# Altium schematic sheet AIRZAI_LED_SENSE_FLEX_REVC.SchDoc
size B
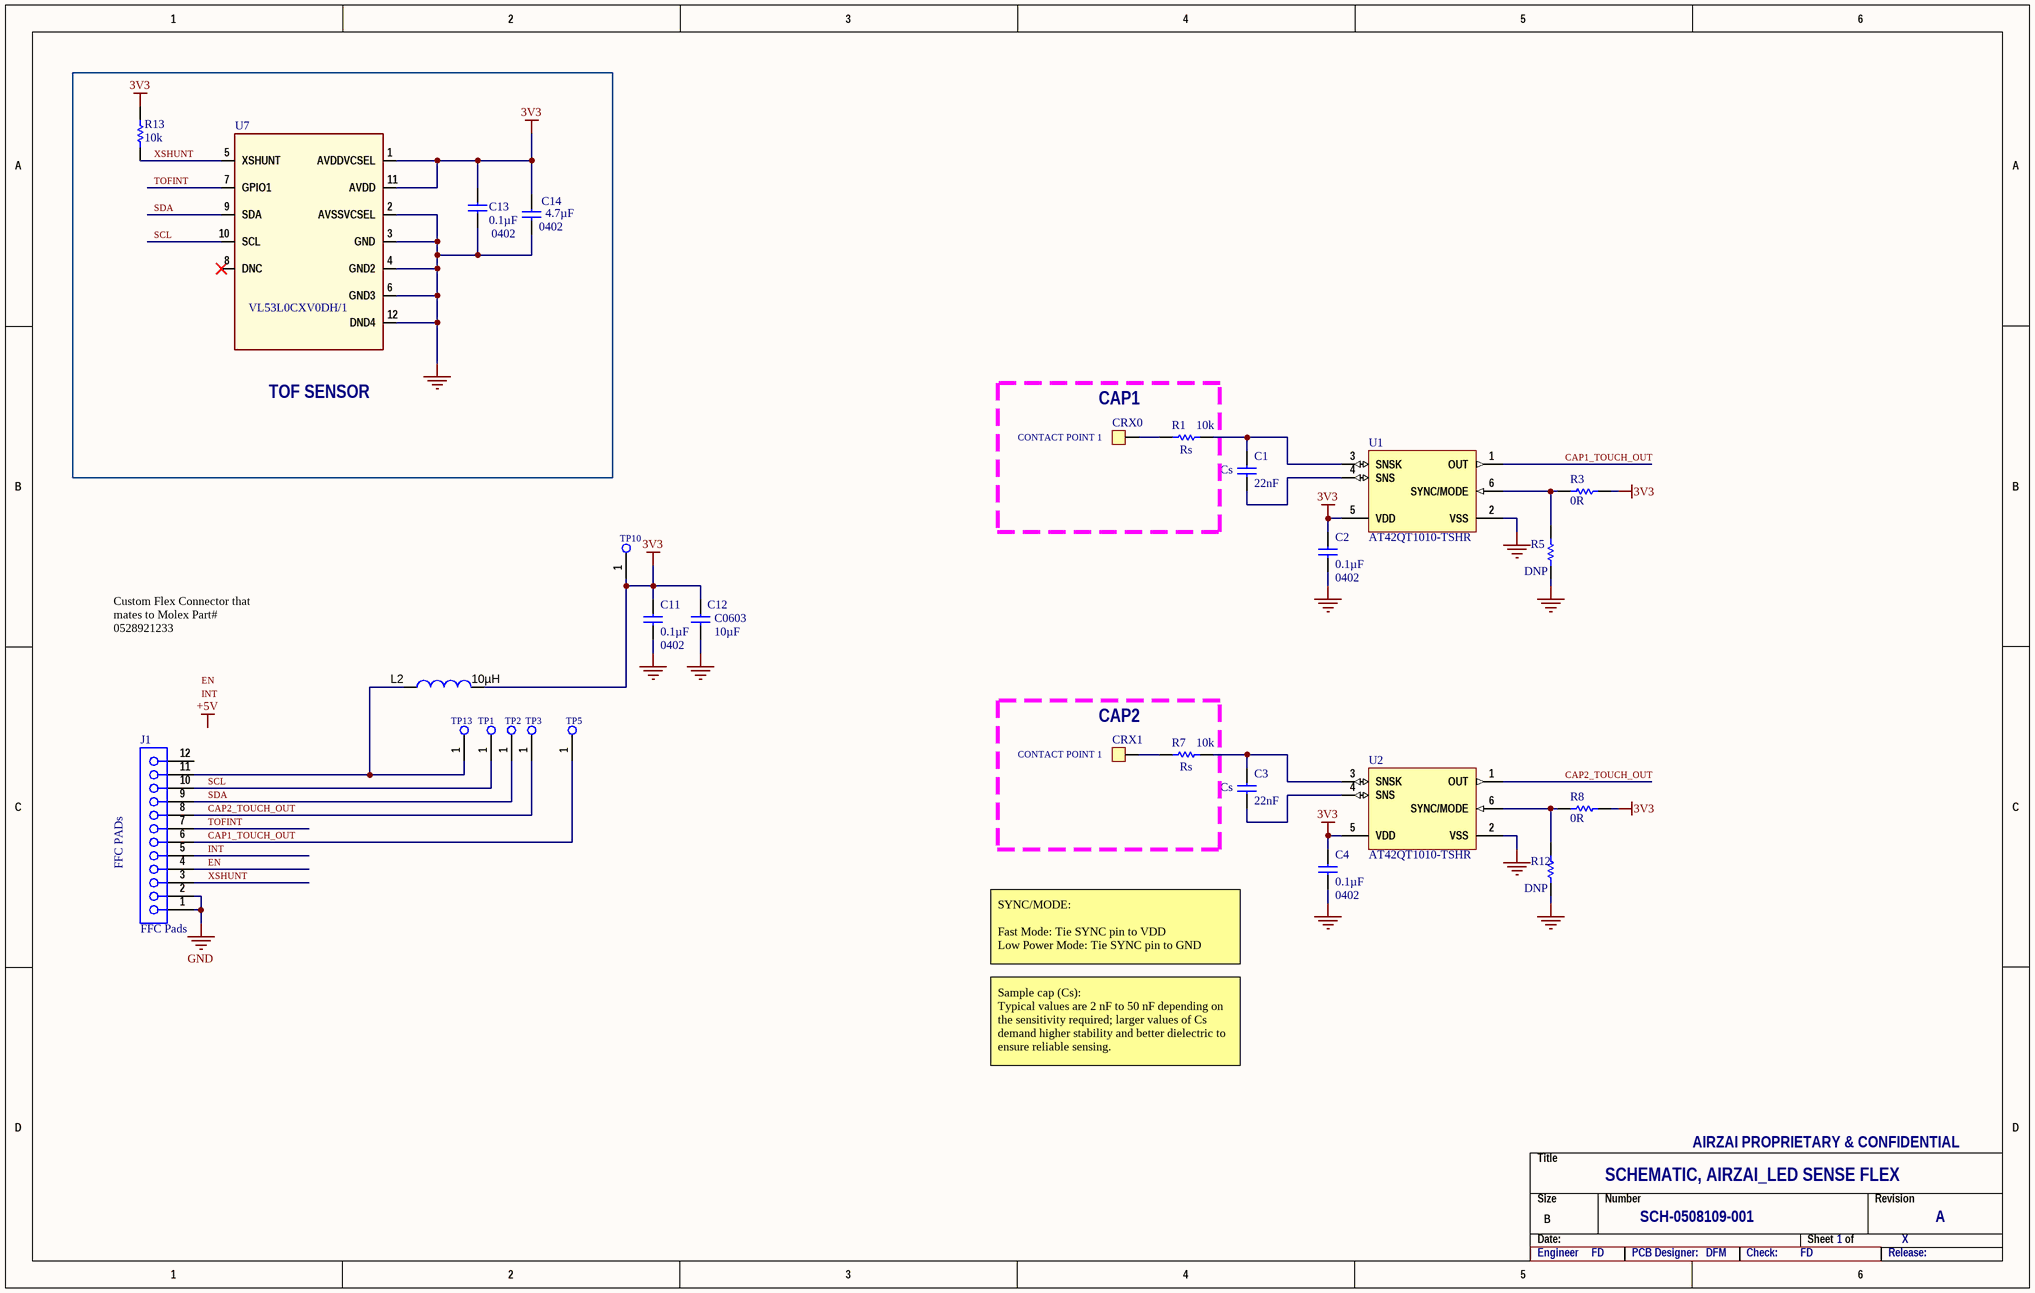
[diagram p0: AIRZAI_LED_SENSE_FLEX_REVC.SchDoc]

## Parts
C1  22nF  [0402CAP]
C2  0.1µF  Footprint: 0402  [0402CAP]
C3  22nF  [0402CAP]
C4  0.1µF  Footprint: 0402  [0402CAP]
C11  0.1µF  Footprint: 0402  [0402CAP]
C12  10µF  Footprint: C0603  [0603]
C13  0.1µF  Footprint: 0402  [0402CAP]
C14  4.7µF  Footprint: 0402  [0603]
CRX0  CONTACT POINT 1  [CONTACT_POINT_1CM _SQ]
CRX1  CONTACT POINT 1  [CONTACT_POINT_1CM _SQ]
J1  FFC Pads  [FFC_Pads]
L2  ValueDisplayed: 10µH  [0805]  (hidden comment: CB2012T100KR)
R1  value 10k  [0402]  (hidden comment: 10k 0402(1005))
R3  value 0R  [0402]  (hidden comment: Jumper 0402(1005))
R5  value DNP  [0402]  (hidden comment: DNP 0402(1005))
R7  value 10k  [0402]  (hidden comment: 10k 0402(1005))
R8  value 0R  [0402]  (hidden comment: Jumper 0402(1005))
R12  value DNP  [0402]  (hidden comment: DNP 0402(1005))
R13  value 10k  [0402]  (hidden comment: 10k 0402(1005))
TP1  Test Point  [TP_0.9MM]  (value not drawn)
TP2  Test Point  [TP_0.9MM]  (value not drawn)
TP3  Test Point  [TP_0.9MM]  (value not drawn)
TP5  Test Point  [TP_0.9MM]  (value not drawn)
TP10  Test Point  [TP_0.9MM]  (value not drawn)
TP13  Test Point  [TP_0.9MM]  (value not drawn)
U1  AT42QT1010-TSHR  [SOT-23-6-AT42QT1010-TSHR]
U2  AT42QT1010-TSHR  [SOT-23-6-AT42QT1010-TSHR]
U7  VL53L0CXV0DH/1  [VL53L0X]

## Blocks framed on the sheet
TOF SENSOR: C13 C14 R13 U7
CAP1: CRX0 R1
CAP2: CRX1 R7

## Nets
3V3: C2.1 C4.1 C11.1 C12.1 C13.1 C14.2 L2.2 R3.2 R8.2 R13.1 TP10.1 U1.5(VDD) U2.5(VDD) U7.1(AVDDVCSEL) U7.11(AVDD)
GND: C2.2 C4.2 C11.2 C12.2 C13.2 C14.1 J1.1 J1.2 R5.2 R12.2 U1.2(VSS) U2.2(VSS) U7.2(AVSSVCSEL) U7.3(GND) U7.4(GND2) U7.6(GND3) U7.12(DND4)
CAP1_TOUCH_OUT: J1.6 TP5.1 U1.1(OUT)
CAP2_TOUCH_OUT: J1.8 TP3.1 U2.1(OUT)
EN: J1.4
INT: J1.5
SCL: J1.10 TP1.1 U7.10(SCL)
SDA: J1.9 TP2.1 U7.9(SDA)
TOFINT: J1.7 U7.7(GPIO1)
XSHUNT: J1.3 R13.2 U7.5(XSHUNT)
NetC1_1: C1.1 R1.1 U1.3(SNSK)
NetC1_2: C1.2 U1.4(SNS)
NetC3_1: C3.1 R7.1 U2.3(SNSK)
NetC3_2: C3.2 U2.4(SNS)
NetCRX0_1: CRX0.1 R1.2
NetCRX1_1: CRX1.1 R7.2
NetJ1_11: J1.11 L2.1 TP13.1
NetR3_1: R3.1 R5.1 U1.6(SYNC/MODE)
NetR8_1: R8.1 R12.1 U2.6(SYNC/MODE)

Not connected (* = marked no-connect by the designer): J1 12; U7 8(DNC)*

## Notes on the sheet
- (near R1) Rs
- (near C1) Cs
- Custom Flex Connector that mates to Molex Part# 0528921233
- (near R7) Rs
- (near C3) Cs
- (near J1) FFC PADs
- SYNC/MODE:
  Fast Mode: Tie SYNC pin to VDD
  Low Power Mode: Tie SYNC pin to GND
- Sample cap (Cs):
  Typical values are 2 nF to 50 nF depending on the sensitivity required; larger values of Cs demand higher stability and better dielectric to ensure reliable sensing.
- SCHEMATIC, AIRZAI_LED SENSE FLEX
- AIRZAI PROPRIETARY & CONFIDENTIAL
- SCH-0508109-001
- 1
- X
- A
- Engineer
- FD
- PCB Designer:
- DFM
- Check:
- Release:
- Labels drawn without touching a wire or pin: +5V, EN, INT

## Library data of the parts
C1 C3 = C0402-100n: Capacitor, X7R, ±10%; Manufacturer: TDK; Manufacturer Part Number: CGA2B2X7R1E223K050BA; Voltage Rating (DC): 25V; Value: 22nF; ComponentLink1URL: http://www.mouser.com/ds/2/281/c02e-2905.pdf?src-supplier=Mouser; ComponentLink1Description: http://www.mouser.com/ds/2/281/c02e-2905.pdf?src-supplier=Mouser; ComponentLink2URL: http://psearch.en.murata.com/capacitor/product/GRM155R71H333KE14%23.pdf?src-supplier=Avnet; ComponentLink2Description: http://psearch.en.murata.com/capacitor/product/GRM155R71H333KE14%23.pdf?src-supplier=Avnet; ComponentLink3URL: http://search.murata.co.jp/Ceramy/image/img/A01X/G101/ENG/GRM155R71H333KE14-01.pdf?src-supplier=Digi-Key; ComponentLink3Description: http://search.murata.co.jp/Ceramy/image/img/A01X/G101/ENG/GRM155R71H333KE14-01.pdf?src-supplier=Digi-Key; Supplier 1: Digi-Key; Supplier Part Number 1: 445-5609-1-ND; Stock 1: 499669; Pricing 1: 1 = 0.10000, 10 = 0.06500, 100 = 0.02910, 500 = 0.02080, 1000 = 0.01635, 2500 = 0.01486, 5000 = 0.01367 (USD); RoHS: Yes; Mount: Surface Mount; Case/Package: 0402; Weight: 2.3E-05oz; Case Code (Imperial): 0402; Case Code (Metric): 1005; Min Operating Temperature: -55°C; Max Operating Temperature: 125°C; Capacitance: 22nF; Tolerance: 10%; Packaging: Tape and Reel; Package Quantity: 1; Voltage Rating: 25V; Dielectric: X7R; Termination: SMD/SMT; Composition: Ceramic; Length: 1mm; Height: 0.5mm; Width: 0.5mm; Thickness: 0.022inch; Depth: 0.5mm; Ratings: AEC-Q200; REACH SVHC: No SVHC; ComponentLink4URL: https://datasheet.ciiva.com/24220/cga2b2x7r1e223k050ba-265693-24220032.pdf?src-supplier=Mouser; ComponentLink4Description: https://datasheet.ciiva.com/24220/cga2b2x7r1e223k050ba-265693-24220032.pdf?src-supplier=Mouser; ComponentLink5URL: https://datasheet.ciiva.com/7975/1807242-7975269.pdf?src-supplier=Element14; ComponentLink5Description: https://datasheet.ciiva.com/7975/1807242-7975269.pdf?src-supplier=Element14
C2 C4 C11 C13 = C0402-100n: Capacitor, X7R, ±10%; Manufacturer: TDK; Manufacturer Part Number: C1005X7R1C104K; Note: 16V ±10% X7R; Case-Metric: 1005; Rated Voltage: 16 V; Tolerance: Â±20%; Datasheet: *; Pin Count: 2; Value: 0.1µF; Supplier: *; Supplier part number: *; 2nd source Supplier: *; 2nd source part number: *; Case-EIA: 0402; Max Thickness: 0.6 mm; Supplier 1: Digi-Key; Supplier Part Number 1: 445-4952-2-ND; Technology: SMT
C12 = C0402-100n: Capacitor, X7R, ±10%; Manufacturer: MURATA; Manufacturer Part Number: GRM188R60J106ME47D; Note: 6.3volts X5R 20%; Case-Metric: 1608; Rated Voltage: 6.3 V; Tolerance: Â±20%; Value: 10µF; Case-EIA: 0603; Max Thickness: 0.9 mm; Pin Count: 2; Supplier 1: Digi-Key; Supplier Part Number 1: 490-3896-6-ND; Technology: SMT
C14 = C0603-1µ0 X7R: Capacitor, X7R, ±10%; Manufacturer: TDK; Manufacturer Part Number: C1005X5R0J475M; Case-Metric: 1005; Note: 6.3volts X5R 20%; Rated Voltage: 6.3 V; Tolerance: Â±20%; Value: 4.7µF; Case-EIA: 0402; Max Thickness: 0.6 mm; Supplier 1: Digi-Key; Supplier Part Number 1: 445-7395-2-ND; Technology: SMT
CRX0 CRX1 = WIRE_POINT
J1 = FFC_PADS: 0.5 mm Pitch FFC Pads; Note: DNP; ComponentLink2URL: http://www.molex.com/webdocs/datasheets/pdf/en-us/0528921233_FFC_FPC_CONNECTORS.pdf; ComponentLink1URL: http://www.molex.com/molex/index.jsp; ComponentLink3URL: http://www.molex.com/pdm_docs/sd/528921233_sd.pdf; ComponentLink2Description: Datasheet; ComponentLink3Description: Package Specification
L2 = CB2012T100KR: Inductor, 10 µH, 0.5A, 0.65 ohm, SMD; Manufacturer: Taiyo Yuden; Value: 10uH; Core Material: Ferrite; Current Rating: 520mA; Saturation Current: 200mA; Tolerance: 10%; Shielding: Unshielded; Self Resonant Frequency: 32MHz; DC Resistance (DCR): 500mR; Test Frequency: 2.52MHz; PartNumber: CB2012T100KR; Value1: 0.65 ohm; Value2: 0.5A; Technology: Wirewound; ComponentLink1Description: Datasheet link; ComponentLink1URL: http://www.yuden.co.jp/ut/product/category/inductor/BRC2012T2R2MD.pdf; Supplier 1: Digi-Key; Manufacturer Part Number: CB2012T100KR; Stock 1: 18059; Pricing 1: 1 = 0.23000, 10 = 0.20700, 100 = 0.14230, 500 = 0.12162, 1000 = 0.09315 (USD); RoHS: Yes; Mount: Surface Mount; Case/Package: 0805; Number of Pins: 2; Case Code (Metric): 2012; Case Code (Imperial): 0805; Min Operating Temperature: -40°C; Max Operating Temperature: 105°C; Package Quantity: 3000; Packaging: Tape and Reel; Inductance Tolerance: 10%; Composition: Wirewound; Inductance: 10uH; Max DC Current: 200mA; Termination: SMD/SMT; Length: 0.079inch; Height: 1.25mm; Width: 0.049inch; Height - Seated (Max): 0.057inch; REACH SVHC: Unknown; Lead Free: Lead Free; Halogen Free: Halogen Free; ComponentLink2URL: https://datasheet.ciiva.com/1040/cb2012t100kr-ss-1040384.pdf?src-supplier=Digi-Key; ComponentLink2Description: https://datasheet.ciiva.com/1040/cb2012t100kr-ss-1040384.pdf?src-supplier=Digi-Key; Supplier Part Number 1: 587-2452-1-ND
R1 R7 R13 = RES: 10k 0.063W 1% 0402 (1005 Metric)  SMD; Manufacturer: Yageo; Manufacturer Part Number: RC0402FR-0710KL; Tolerance: None; Case-Metric: 1005; Note: RES SMD 10K OHM 1% 1/16W 0402; Power: 0.063W; Case-EIA: 0402; Technology: SMT; Max Thickness: 0.6 mm; Pin Count: 2; Supplier 1: Digi-Key; Supplier Part Number 1: 311-10.0KLRCT-ND
R3 R8 = RES: Jumper 0402 (1005 Metric); Manufacturer: Panasonic; Manufacturer Part Number: ERJ-2GE0R00X; Tolerance: None; Case-Metric: 1005; Note: 0.1W JUMPER; Power: None; Case-EIA: 0402; Technology: SMT; Max Thickness: 0.6 mm; Pin Count: 2; Supplier 1: Digi-Key; Supplier Part Number 1: P0.0JCT-ND
R5 R12 = RES: DNP; Tolerance: None; Case-Metric: 1005; Power: 0.0625 W; Case-EIA: 0402; Technology: SMT; Manufacturer Part Number: DNP; Max Thickness: 0.6 mm; Note: DNP; Pin Count: 2; Supplier 1: Digi-Key; Supplier Part Number 1: DNP
U1 U2 = AT42QT1010-TSHR: One-channel Touch Sensor IC with Reset Timer, -40° to +85° C, 6-pin SOT23; ComponentLink1Description: Manufacturer URL; ComponentLink2Description: Datasheet; DatasheetVersion: revH, May-2010; ComponentLink1URL: http://www.atmel.com/; Code_JEDEC: MO-178-AB; Code_IPC: SOT26A-6; PackageVersion: revA, Jun-2008; PackageDescription: 6-Lead, 2.90 x 1.60 mm Plastic Small Outline Package (SOT23); ComponentLink2URL: http://www.atmel.com/Images/doc9541.pdf; PackageReference: 6ST1; PartNumber: AT42QT1010-TSHR; Supplier Part Number 1: AT42QT1010-TSHRCT-ND
U7 = VL53L0X: Manufacturer: ST; Note: SENSOR LASER DISTANCE TOF 2M; Case-EIA: LGA12; Tolerance: None; Manufacturer Part Number: VL53L0CXV0DH/1; Value: VL53L0CXV0DH/1; Supplier 1: Digi-Key; Supplier Part Number 1: 497-16538-1-ND; Technology: SMT